# EAGLE design Shruthi-Analog-CS80-SVF-v01 (EAGLE 5.12)
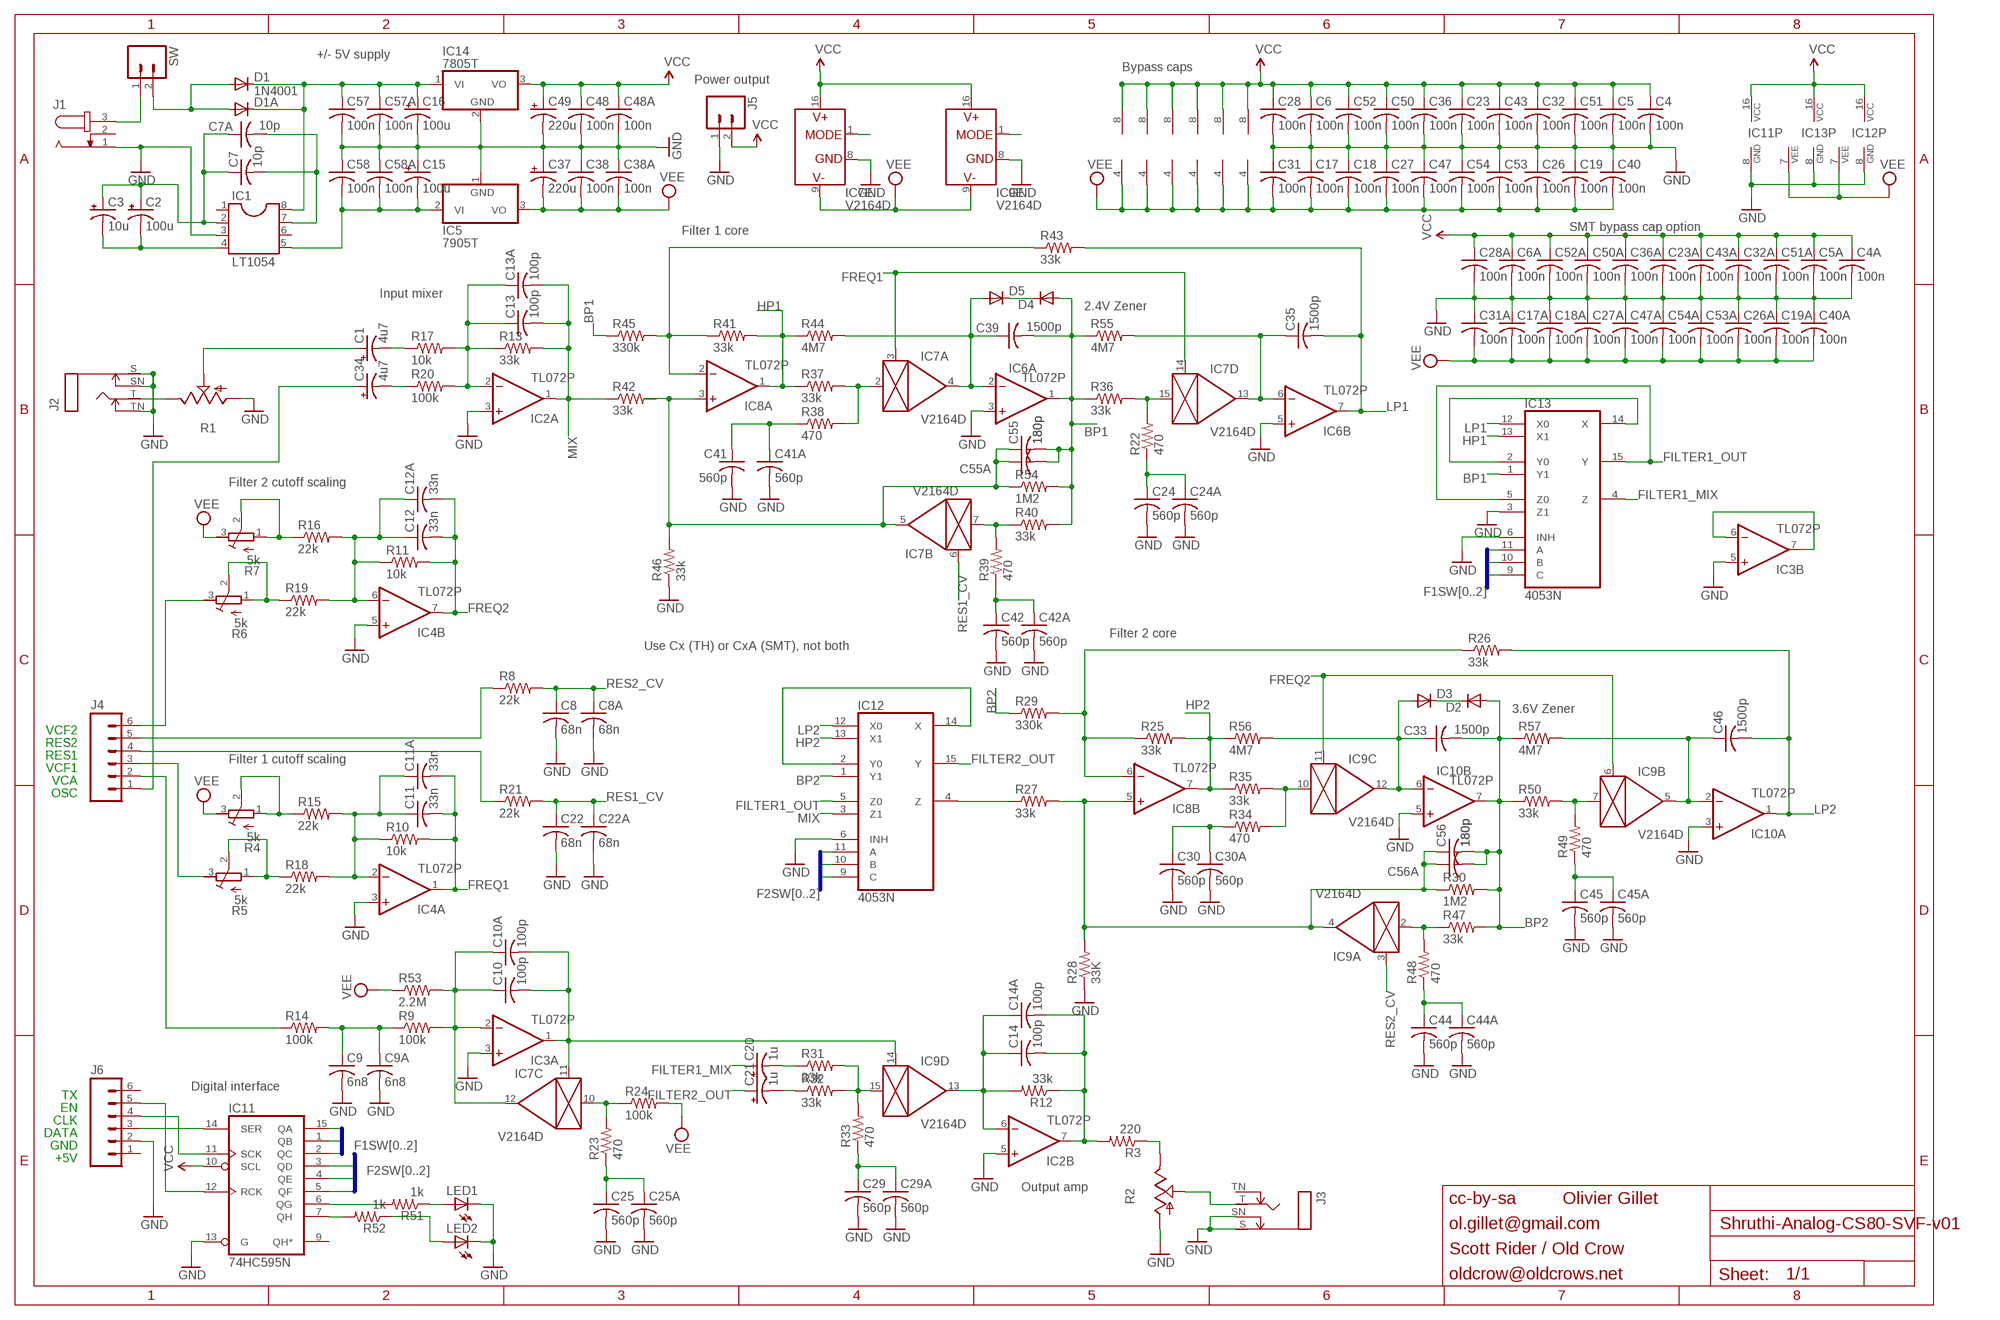
[diagram p0: schematic, sheet 1]

## Parts
C1  4u7  CPOL-USE2.5-6  [E2,5-6]
C2  100u  CPOL-USE2.5-6  [E2,5-6]
C3  10u  CPOL-USE2.5-5  [E2,5-5]
C4  100n  C-US050-025X075  [C050-025X075]
C4A  100n  C-USC0805K  [C0805K]
C5  100n  C-US050-025X075  [C050-025X075]
C5A  100n  C-USC0805K  [C0805K]
C6  100n  C-US050-025X075  [C050-025X075]
C6A  100n  C-USC0805K  [C0805K]
C7  10p  C-US050-025X075  [C050-025X075]
C7A  10p  C-USC0805K  [C0805K]
C8  68n  C-US050-025X075  [C050-025X075]
C8A  68n  C-USC0805K  [C0805K]
C9  6n8  C-US050-025X075  [C050-025X075]
C9A  6n8  C-USC0805K  [C0805K]
C10  100p  C-US050-025X075  [C050-025X075]
C10A  100p  C-USC0805K  [C0805K]
C11  33n  C-US050-025X075  [C050-025X075]
C11A  33n  C-USC0805K  [C0805K]
C12  33n  C-US050-025X075  [C050-025X075]
C12A  33n  C-USC0805K  [C0805K]
C13  100p  C-US050-025X075  [C050-025X075]
C13A  100p  C-USC0805K  [C0805K]
C14  100p  C-US050-025X075  [C050-025X075]
C14A  100p  C-USC0805K  [C0805K]
C15  100u  CPOL-USE2.5-7  [E2,5-7]
C16  100u  CPOL-USE2.5-7  [E2,5-7]
C17  100n  C-US050-025X075  [C050-025X075]
C17A  100n  C-USC0805K  [C0805K]
C18  100n  C-US050-025X075  [C050-025X075]
C18A  100n  C-USC0805K  [C0805K]
C19  100n  C-US050-025X075  [C050-025X075]
C19A  100n  C-USC0805K  [C0805K]
C20  1u  CPOL-USE2-5  [E2-5]
C21  1u  CPOL-USE2-5  [E2-5]
C22  68n  C-US050-025X075  [C050-025X075]
C22A  68n  C-USC0805K  [C0805K]
C23  100n  C-US050-025X075  [C050-025X075]
C23A  100n  C-USC0805K  [C0805K]
C24  560p  C-US050-025X075  [C050-025X075]
C24A  560p  C-USC0805K  [C0805K]
C25  560p  C-US050-025X075  [C050-025X075]
C25A  560p  C-USC0805K  [C0805K]
C26  100n  C-US050-025X075  [C050-025X075]
C26A  100n  C-USC0805K  [C0805K]
C27  100n  C-US050-025X075  [C050-025X075]
C27A  100n  C-USC0805K  [C0805K]
C28  100n  C-US050-025X075  [C050-025X075]
C28A  100n  C-USC0805K  [C0805K]
C29  560p  C-US050-025X075  [C050-025X075]
C29A  560p  C-USC0805K  [C0805K]
C30  560p  C-US050-025X075  [C050-025X075]
C30A  560p  C-USC0805K  [C0805K]
C31  100n  C-US050-025X075  [C050-025X075]
C31A  100n  C-USC0805K  [C0805K]
C32  100n  C-US050-025X075  [C050-025X075]
C32A  100n  C-USC0805K  [C0805K]
C33  1500p  C-US025-025X050  [C025-025X050]
C34  4u7  CPOL-USE2.5-6  [E2,5-6]
C35  1500p  C-US025-025X050  [C025-025X050]
C36  100n  C-US050-025X075  [C050-025X075]
C36A  100n  C-USC0805K  [C0805K]
C37  220u  CPOL-USE3.5-8  [E3,5-8]
C38  100n  C-US050-025X075  [C050-025X075]
C38A  100n  C-USC0805K  [C0805K]
C39  1500p  C-US025-025X050  [C025-025X050]
C40  100n  C-US050-025X075  [C050-025X075]
C40A  100n  C-USC0805K  [C0805K]
C41  560p  C-US050-025X075  [C050-025X075]
C41A  560p  C-USC0805K  [C0805K]
C42  560p  C-US050-025X075  [C050-025X075]
C42A  560p  C-USC0805K  [C0805K]
C43  100n  C-US050-025X075  [C050-025X075]
C43A  100n  C-USC0805K  [C0805K]
C44  560p  C-US050-025X075  [C050-025X075]
C44A  560p  C-USC0805K  [C0805K]
C45  560p  C-US050-025X075  [C050-025X075]
C45A  560p  C-USC0805K  [C0805K]
C46  1500p  C-US025-025X050  [C025-025X050]
C47  100n  C-US050-025X075  [C050-025X075]
C47A  100n  C-USC0805K  [C0805K]
C48  100n  C-US050-025X075  [C050-025X075]
C48A  100n  C-USC0805K  [C0805K]
C49  220u  CPOL-USE3.5-8  [E3,5-8]
C50  100n  C-US050-025X075  [C050-025X075]
C50A  100n  C-USC0805K  [C0805K]
C51  100n  C-US050-025X075  [C050-025X075]
C51A  100n  C-USC0805K  [C0805K]
C52  100n  C-US050-025X075  [C050-025X075]
C52A  100n  C-USC0805K  [C0805K]
C53  100n  C-US025-025X050  [C025-025X050]
C53A  100n  C-USC0805K  [C0805K]
C54  100n  C-US050-025X075  [C050-025X075]
C54A  100n  C-USC0805K  [C0805K]
C55  180p  C-US050-025X075  [C050-025X075]
C55A  180p  C-USC0805K  [C0805K]
C56  180p  C-US050-025X075  [C050-025X075]
C56A  180p  C-USC0805K  [C0805K]
C57  100n  C-US050-025X075  [C050-025X075]
C57A  100n  C-USC0805K  [C0805K]
C58  100n  C-US050-025X075  [C050-025X075]
C58A  100n  C-USC0805K  [C0805K]
D1  1N4001  1N4004  [DO41-10]
D1A  DIODE-SMB  [SMB]
D2  DIODE-D-5  [D-5]
D3  DIODE-D-5  [D-5]
D4  DIODE-D-5  [D-5]
D5  DIODE-D-5  [D-5]
IC1  LT1054  DIL8  [DIL08]
IC2  TL072P  [DIL08]
IC3  TL072P  [DIL08]
IC4  TL072P  [DIL08]
IC5  7905T  [TO220H]
IC6  TL072P  [DIL08]
IC7  V2164D  SSM2164P  [DIL16]
IC8  TL072P  [DIL08]
IC9  V2164D  SSM2164P  [DIL16]
IC10  TL072P  [DIL08]
IC11  74HC595N  [DIL16]
IC12  4053N  [DIL16]
IC13  4053N  [DIL16]
IC14  7805T  [TO220H]
J1  JACK-PLUG2  [SPC4078_BIG_HOLES]
J2  MONOSWS  [NMJ4HC-S]
J3  MONOSWS  [NMJ4HC-S]
J4  M06SIP  [1X06]
J5  M02PTH  [1X02]
J6  M06SIP  [1X06]
LED1  LEDCHIP-LED0603  [CHIP-LED0603]
LED2  LEDCHIP-LED0603  [CHIP-LED0603]
R1  POT_USCABLED  [CABLE_POT_6MM]
R2  POT_USCABLED  [CABLE_POT_6MM]
R3  220  R-US_0204/7  [0204/7]
R4  5k  R-TRIMM3296X  [RTRIM3296X]
R5  5k  R-TRIMM3296X  [RTRIM3296X]
R6  5k  R-TRIMM3296X  [RTRIM3296X]
R7  5k  R-TRIMM3296X  [RTRIM3296X]
R8  22k  R-US_0204/7  [0204/7]
R9  100k  R-US_0204/7  [0204/7]
R10  10k  R-US_0204/7  [0204/7]
R11  10k  R-US_0204/7  [0204/7]
R12  33k  R-US_0204/7  [0204/7]
R13  33k  R-US_0204/7  [0204/7]
R14  100k  R-US_0204/7  [0204/7]
R15  22k  R-US_0204/7  [0204/7]
R16  22k  R-US_0204/7  [0204/7]
R17  10k  R-US_0204/7  [0204/7]
R18  22k  R-US_0204/7  [0204/7]
R19  22k  R-US_0204/7  [0204/7]
R20  100k  R-US_0204/7  [0204/7]
R21  22k  R-US_0204/7  [0204/7]
R22  470  R-US_0204/7  [0204/7]
R23  470  R-US_0204/7  [0204/7]
R24  100k  R-US_0204/7  [0204/7]
R25  33k  R-US_0204/7  [0204/7]
R26  33k  R-US_0204/7  [0204/7]
R27  33k  R-US_0204/7  [0204/7]
R28  33K  R-US_0204/7  [0204/7]
R29  330k  R-US_0204/7  [0204/7]
R30  1M2  R-US_0204/7  [0204/7]
R31  33k  R-US_0204/7  [0204/7]
R32  33k  R-US_0204/7  [0204/7]
R33  470  R-US_0204/7  [0204/7]
R34  470  R-US_0204/7  [0204/7]
R35  33k  R-US_0204/7  [0204/7]
R36  33k  R-US_0204/7  [0204/7]
R37  33k  R-US_0204/7  [0204/7]
R38  470  R-US_0204/7  [0204/7]
R39  470  R-US_0204/7  [0204/7]
R40  33k  R-US_0204/7  [0204/7]
R41  33k  R-US_0204/7  [0204/7]
R42  33k  R-US_0204/7  [0204/7]
R43  33k  R-US_0204/7  [0204/7]
R44  4M7  R-US_0204/7  [0204/7]
R45  330k  R-US_0204/7  [0204/7]
R46  33k  R-US_0204/7  [0204/7]
R47  33k  R-US_0204/7  [0204/7]
R48  470  R-US_0204/7  [0204/7]
R49  470  R-US_0204/7  [0204/7]
R50  33k  R-US_0204/7  [0204/7]
R51  1k  R-US_0204/7  [0204/7]
R52  1k  R-US_0204/7  [0204/7]
R53  2.2M  R-US_0204/2V  [0204V]
R54  1M2  R-US_0204/7  [0204/7]
R55  4M7  R-US_0204/7  [0204/7]
R56  4M7  R-US_0204/7  [0204/7]
R57  4M7  R-US_0204/7  [0204/7]
SW  M02PTH  [1X02]

## Nets
BP1: C39.2 C55.2 C55A.2 D4.A IC6.1(A:OUT) IC13.1(Y1) R36.1 R40.2 R45.1 R54.2 R55.1
BP2: C33.2 C56.2 C56A.2 D2.A IC10.7(B:OUT) IC12.1(Y1) R29.1 R30.2 R47.2 R50.1 R57.1
F1SW0: IC11.15(QA) IC13.9(C)
F1SW1: IC11.1(QB) IC13.10(B)
F1SW2: IC11.2(QC) IC13.11(A)
F2SW0: IC11.3(QD) IC12.9(C)
F2SW1: IC11.4(QE) IC12.10(B)
F2SW2: IC11.5(QF) IC12.11(A)
FILTER1_MIX: C20.+ IC13.4(Z)
FILTER1_OUT: IC12.5(Z0) IC13.5(Z0) IC13.15(Y)
FILTER2_OUT: C21.+ IC12.15(Y)
FREQ1: C11.2 C11A.2 IC4.1(A:OUT) IC7.3(A:CTRL) IC7.14(D:CTRL) R10.2
FREQ2: C12.2 C12A.2 IC4.7(B:OUT) IC9.6(B:CTRL) IC9.11(C:CTRL) R11.2
GND: C4.2 C4A.2 C5.2 C5A.2 C6.2 C6A.2 C8.2 C8A.2 C9.2 C9A.2 C15.+ C16.- C17.1 C17A.1 C18.1 C18A.1 C19.1 C19A.1 C22.2 C22A.2 C23.2 C23A.2 C24.2 C24A.2 C25.2 C25A.2 C26.1 C26A.1 C27.1 C27A.1 C28.2 C28A.2 C29.2 C29A.2 C30.2 C30A.2 C31.1 C31A.1 C32.2 C32A.2 C36.2 C36A.2 C37.+ C38.1 C38A.1 C40.1 C40A.1 C41.2 C41A.2 C42.2 C42A.2 C43.2 C43A.2 C44.2 C44A.2 C45.2 C45A.2 C47.1 C47A.1 C48.2 C48A.2 C49.- C50.2 C50A.2 C51.2 C51A.2 C52.2 C52A.2 C53.1 C53A.1 C54.1 C54A.1 C57.2 C57A.2 C58.1 C58A.1 IC1.3 IC2.3(A:+IN) IC2.5(B:+IN) IC3.3(A:+IN) IC3.5(B:+IN) IC4.3(A:+IN) IC4.5(B:+IN) IC5.1(GND) IC6.3(A:+IN) IC6.5(B:+IN) IC7.8(E:GND) IC9.8(E:GND) IC10.3(A:+IN) IC10.5(B:+IN) IC11.8(GND) IC11.13(G) IC12.6(INH) IC12.8(GND) IC13.3(Z1) IC13.6(INH) IC13.8(GND) IC14.2(GND) J1.1 J2.S J2.SN J2.TN J3.S J3.SN J5.1 J6.2 LED1.C LED2.C R1.A R2.A R28.1 R46.1
HP1: IC8.1(A:OUT) IC13.13(X1) R37.1 R41.2 R44.1
HP2: IC8.7(B:OUT) IC12.13(X1) R25.2 R35.1 R56.1
LP1: C35.2 IC6.7(B:OUT) IC13.12(X0) R43.2
LP2: C46.2 IC10.1(A:OUT) IC12.12(X0) R26.2
MIX: C13.2 C13A.2 IC2.1(A:OUT) IC12.3(Z1) R13.2 R42.1
N$1: C2.+ C3.+ C7.1 C7A.1 IC1.2
N$2: C12.1 C12A.1 IC4.6(B:-IN) R11.1 R16.2 R19.2
N$3: J1.3 SW.1
N$4: C16.+ C57.1 C57A.1 D1.C D1A.C IC1.8 IC14.1(VI)
N$5: C2.- C3.- IC1.4
N$6: C13.1 C13A.1 IC2.2(A:-IN) R13.1 R17.2 R20.2
N$7: R6.1(E) R6.2(S) R19.1
N$8: J4.6 R6.3(A)
N$9: R7.1(E) R7.2(S) R16.1
N$10: IC7.10(C:IN) R23.2 R24.1
N$11: C10.1 C10A.1 IC3.2(A:-IN) IC7.12(C:OUT) R9.2 R53.2
N$12: IC8.2(A:-IN) R41.1 R43.1 R45.2
N$13: IC11.12(RCK) J6.5
N$14: IC11.14(SER) J6.3
N$15: IC11.6(QG) R51.2
N$16: IC11.11(SCK) J6.4
N$17: C24.1 C24A.1 R22.1
N$18: IC8.6(B:-IN) R25.1 R26.1 R29.2
N$19: C39.1 D5.A IC6.2(A:-IN) IC7.4(A:OUT) R44.2
N$20: C33.1 D3.A IC9.12(C:OUT) IC10.6(B:-IN) R56.2
N$21: IC7.7(B:IN) R39.2 R40.1
N$22: C9.1 C9A.1 R9.1 R14.2
N$23: C56.1 C56A.1 IC8.5(B:+IN) IC9.4(A:OUT) R27.2 R28.2 R30.1
N$24: IC9.2(A:IN) R47.1 R48.2
N$25: R2.E R3.1
N$26: IC7.15(D:IN) R22.2 R36.2
N$27: C42.1 C42A.1 R39.1
N$28: C35.1 IC6.6(B:-IN) IC7.13(D:OUT) R55.2
N$29: IC7.2(A:IN) R37.2 R38.2
N$30: C41.1 C41A.1 R38.1
N$31: C55.1 C55A.1 IC7.5(B:OUT) IC8.3(A:+IN) R42.2 R46.2 R54.1
N$32: LED1.A R51.1
N$33: D2.C D3.C
N$34: IC9.7(B:IN) R49.2 R50.2
N$35: C34.+ J4.1
N$36: C7.2 C7A.2 IC1.7
N$38: J2.T R1.E
N$39: C34.- R20.1
N$40: C11.1 C11A.1 IC4.2(A:-IN) R10.1 R15.2 R18.2
N$41: R5.1(E) R5.2(S) R18.1
N$42: J4.3 R5.3(A)
N$43: R4.1(E) R4.2(S) R15.1
N$44: C46.1 IC9.5(B:OUT) IC10.2(A:-IN) R57.2
N$45: J4.2 R14.1
N$46: C45.1 C45A.1 R49.1
N$47: J3.T R2.S
N$49: C44.1 C44A.1 R48.1
N$50: IC9.10(C:IN) R34.2 R35.2
N$51: C30.1 C30A.1 R34.1
N$52: LED2.A R52.1
N$53: IC11.7(QH) R52.2
N$55: D4.C D5.C
N$56: C10.2 C10A.2 IC3.1(A:OUT) IC7.11(C:CTRL) IC9.14(D:CTRL)
N$57: C20.- R31.1
N$58: C15.- C58.2 C58A.2 IC1.5 IC5.2(VI)
N$59: D1.A D1A.A SW.2
N$60: C21.- R32.1
N$61: IC3.6(B:-IN) IC3.7(B:OUT)
N$62: IC13.2(Y0) IC13.14(X)
N$63: C14.2 C14A.2 IC2.7(B:OUT) R3.2 R12.1
N$64: C25.1 C25A.1 R23.1
N$65: C29.1 C29A.1 R33.1
N$66: C1.+ R1.S
N$67: IC9.15(D:IN) R31.2 R32.2 R33.2
N$68: IC7.1(E:MODE)
N$69: J4.4 R21.1
N$70: C14.1 C14A.1 IC2.6(B:-IN) IC9.13(D:OUT) R12.2
N$71: IC9.1(E:MODE)
N$72: C1.- R17.1
N$73: J4.5 R8.1
N$74: IC12.2(Y0) IC12.14(X)
N$75: IC12.4(Z) R27.1
RES1_CV: C22.1 C22A.1 IC7.6(B:CTRL) R21.2
RES2_CV: C8.1 C8A.1 IC9.3(A:CTRL) R8.2
VCC: C4.1 C4A.1 C5.1 C5A.1 C6.1 C6A.1 C23.1 C23A.1 C28.1 C28A.1 C32.1 C32A.1 C36.1 C36A.1 C43.1 C43A.1 C48.1 C48A.1 C49.+ C50.1 C50A.1 C51.1 C51A.1 C52.1 C52A.1 IC2.8(P:V+) IC3.8(P:V+) IC4.8(P:V+) IC6.8(P:V+) IC7.16(E:V+) IC8.8(P:V+) IC9.16(E:V+) IC10.8(P:V+) IC11.10(SCL) IC11.16(VCC) IC12.16(VCC) IC13.16(VCC) IC14.3(VO) J5.2
VEE: C17.2 C17A.2 C18.2 C18A.2 C19.2 C19A.2 C26.2 C26A.2 C27.2 C27A.2 C31.2 C31A.2 C37.- C38.2 C38A.2 C40.2 C40A.2 C47.2 C47A.2 C53.2 C53A.2 C54.2 C54A.2 IC2.4(P:V-) IC3.4(P:V-) IC4.4(P:V-) IC5.3(VO) IC6.4(P:V-) IC7.9(E:V-) IC8.4(P:V-) IC9.9(E:V-) IC10.4(P:V-) IC12.7(VEE) IC13.7(VEE) R4.3(A) R7.3(A) R24.2 R53.1
Unconnected: IC1.1 IC1.6 IC11.9(QH*) J1.2 J3.TN J6.1 J6.6

## Buses
F1SW[0..2]
F2SW[0..2]

## Notes on the sheet
- +/- 5V supply
- Bypass caps
- Power output
- SMT bypass cap option
- Filter 1 core
- Input mixer
- 2.4V Zener
- Filter 2 cutoff scaling
- Filter 2 core
- Use Cx (TH) or CxA (SMT), not both
- 3.6V Zener
- VCF2
- RES2
- RES1
- VCF1 | Filter 1 cutoff scaling
- VCA
- OSC
- TX | Digital interface
- EN
- CLK
- DATA
- GND
- +5V
- Output amp
- cc-by-sa | Olivier Gillet
- ol.gillet@gmail.com
- Scott Rider / Old Crow
- oldcrow@oldcrows.net

## Library data of the parts
C1-C3 C15 C16 C20 C21 C34 C37 C49 = rcl:CPOL-US: POLARIZED CAPACITOR, American symbol
C4 C4A C5 C5A C6 C6A C7 C7A C8 C8A C9 C9A C10 C10A C11 C11A C12 C12A C13 C13A C14 C14A C17 C17A C18 C18A C19 C19A C22 C22A C23 C23A C24 C24A C25 C25A C26 C26A C27 C27A C28 C28A C29 C29A C30 C30A C31 C31A C32 C32A C33 C35 C36 C36A C38 C38A C39 C40 C40A C41 C41A C42 C42A C43 C43A C44 C44A C45 C45A C46 C47 C47A C48 C48A C50 C50A C51 C51A C52 C52A C53 C53A C54 C54A C55 C55A C56 C56A C57 C57A C58 C58A = rcl:C-US: CAPACITOR, American symbol
D1 = diode:1N4004: DIODE general purpose rectifier, 1 A
D1A D2-D5 = diode:DIODE-: DIODE
IC1 = ic-package:DIL8: Dual In Line / Socket
IC2-IC4 IC6 IC8 IC10 = og-linear:TL072: OP AMP
IC5 = linear:79*: Negative VOLTAGE REGULATOR
IC7 IC9 = ssm2164:SSM2164
IC11 = 74xx-eu:74*595: 8-bit SHIFT REGISTER, output latch
IC12 IC13 = 40xx:4053: Triple 2-channel ANALOG MULTIPLEXER
IC14 = linear:78*: Positive VOLTAGE REGULATOR Source: http://cache.national.com/ds/LM/LM78L05.pdf http://www.fairchildsemi.com/ds/LM/LM7805.pdf
J1 = con-jack2:JACK-PLUG: DC POWER JACK Power Jack, DC, Right Angle, Through Hole, Rated 5A at 16VDC, PC Terminals Distributor: Farnell (www.Farnell.de) Drawing: 84N1161.pdf / 84N1162.pdf Manufacturer: SPC Technology (www.spctechnology.com) Type: SPC4077 / SPC 4078
J2 J3 = gm-jacks:MONOSW
J4 J6 = SparkFun:M06: Header 6 Standard 6-pin 0.1" header. Use with straight break away headers (SKU : PRT-00116), right angle break away headers (PRT-00553), swiss pins (PRT-00743), machine pins (PRT-00117), and female headers (PRT-00115). Molex polarized connector foot print use with SKU : PRT-08094 with associated crimp pins and housings. NOTES ON THE VARIANTS LOCK and LOCK_LONGPADS... This footprint was designed to help hold the alignment of a through-hole component (i.e. 6-pin header) while soldering it into place. You may notice that each hole has been shifted either up or down by 0.005 of an inch from it's more standard position (which is a perfectly straight line). This slight alteration caused the pins (the squares in the middle) to touch the edges of the holes. Because they are alternating, it causes a "brace" to hold the component in place. 0.005 has proven to be the perfect amount of "off-center" position when using our standard breakaway headers. Although looks a little odd when you look at the bare footprint, once you have a header in there, the alteration is very hard to notice. Also, if you push a header all the way into place, it is covered up entirely on the bottom side. This idea of altering the position of holes to aid alignment will be further integrated into the Sparkfun Library for other footprints. It can help hold any component with 3 or more connection pins.
J5 SW = SparkFun:M02: Header 2 Standard 2-pin 0.1" header. Use with straight break away headers (SKU : PRT-00116), right angle break away headers (PRT-00553), swiss pins (PRT-00743), machine pins (PRT-00117), and female headers (PRT-00115). Molex polarized connector foot print use with SKU : PRT-08233 with associated crimp pins and housings.
LED1 LED2 = led:LED: LED OSRAM: - CHIPLED LG R971, LG N971, LY N971, LG Q971, LY Q971, LO R971, LY R971 LH N974, LH R974 LS Q976, LO Q976, LY Q976 LO Q996 - Hyper CHIPLED LW Q18S LB Q993, LB Q99A, LB R99A - SideLED LS A670, LO A670, LY A670, LG A670, LP A670 LB A673, LV A673, LT A673, LW A673 LH A674 LY A675 LS A676, LA A676, LO A676, LY A676, LW A676 LS A679, LY A679, LG A679 - Hyper Micro SIDELED® LS Y876, LA Y876, LO Y876, LY Y876 LT Y87S - SmartLED LW L88C, LW L88S LB L89C, LB L89S, LG L890 LS L89K, LO L89K, LY L89K LS L896, LA L896, LO L896, LY L896 - TOPLED LS T670, LO T670, LY T670, LG T670, LP T670 LSG T670, LSP T670, LSY T670, LOP T670, LYG T670 LG T671, LOG T671, LSG T671 LB T673, LV T673, LT T673, LW T673 LH T674 LS T676, LA T676, LO T676, LY T676, LB T676, LH T676, LSB T676, LW T676 LB T67C, LV T67C, LT T67C, LS T67K, LO T67K, LY T67K, LW E67C LS E67B, LA E67B, LO E67B, LY E67B, LB E67C, LV E67C, LT E67C LW T67C LS T679, LY T679, LG T679 LS T770, LO T770, LY T770, LG T770, LP T770 LB T773, LV T773, LT T773, LW T773 LH T774 LS E675, LA E675, LY E675, LS T675 LS T776, LA T776, LO T776, LY T776, LB T776 LHGB T686 LT T68C, LB T68C - Hyper Mini TOPLED® LB M676 - Mini TOPLED Santana® LG M470 LS M47K, LO M47K, LY M47K Source: http://www.osram.convergy.de LUXEON: - LUMILED® LXK2-PW12-R00, LXK2-PW12-S00, LXK2-PW14-U00, LXK2-PW14-V00 LXK2-PM12-R00, LXK2-PM12-S00, LXK2-PM14-U00 LXK2-PE12-Q00, LXK2-PE12-R00, LXK2-PE12-S00, LXK2-PE14-T00, LXK2-PE14-U00 LXK2-PB12-K00, LXK2-PB12-L00, LXK2-PB12-M00, LXK2-PB14-N00, LXK2-PB14-P00, LXK2-PB14-Q00 LXK2-PR12-L00, LXK2-PR12-M00, LXK2-PR14-Q00, LXK2-PR14-R00 LXK2-PD12-Q00, LXK2-PD12-R00, LXK2-PD12-S00 LXK2-PH12-R00, LXK2-PH12-S00 LXK2-PL12-P00, LXK2-PL12-Q00, LXK2-PL12-R00 Source: www.luxeon.com KINGBRIGHT: KA-3528ASYC Source: www.kingbright.com
R1 R2 = pot-alps:POT_US
R3 R8-R57 = rcl:R-US_: RESISTOR, American symbol
R4-R7 = rcl:R-TRIMM: Trimm resistor

## Board
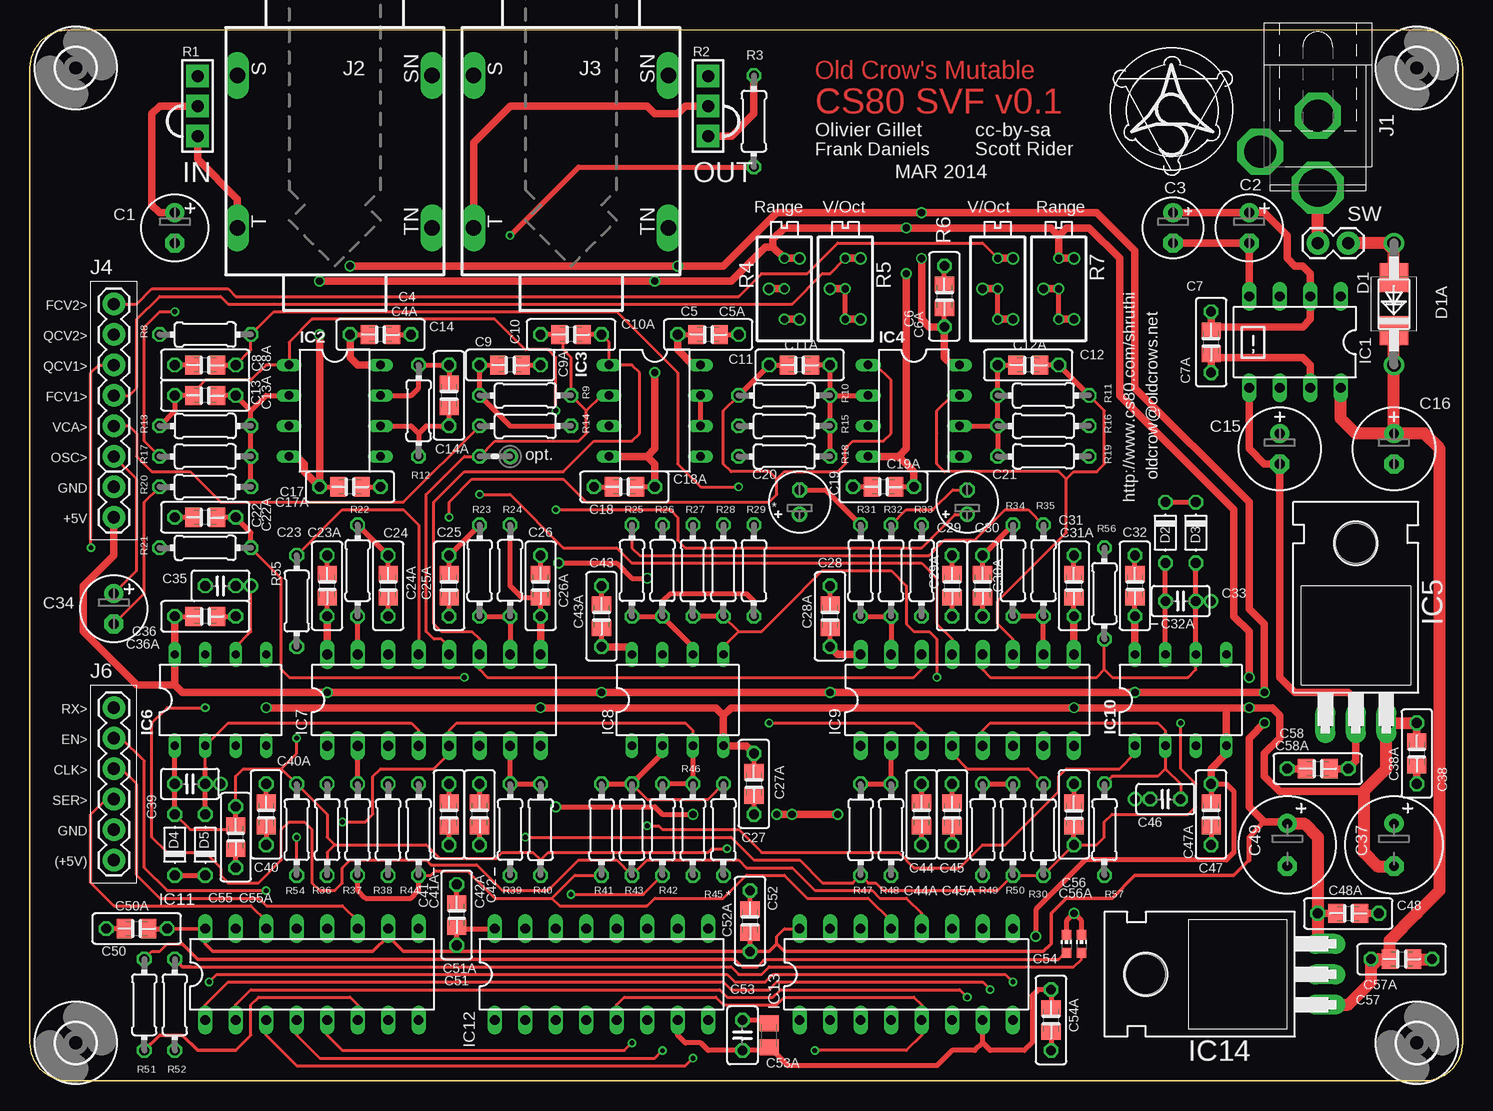
[diagram p1: board, top side]
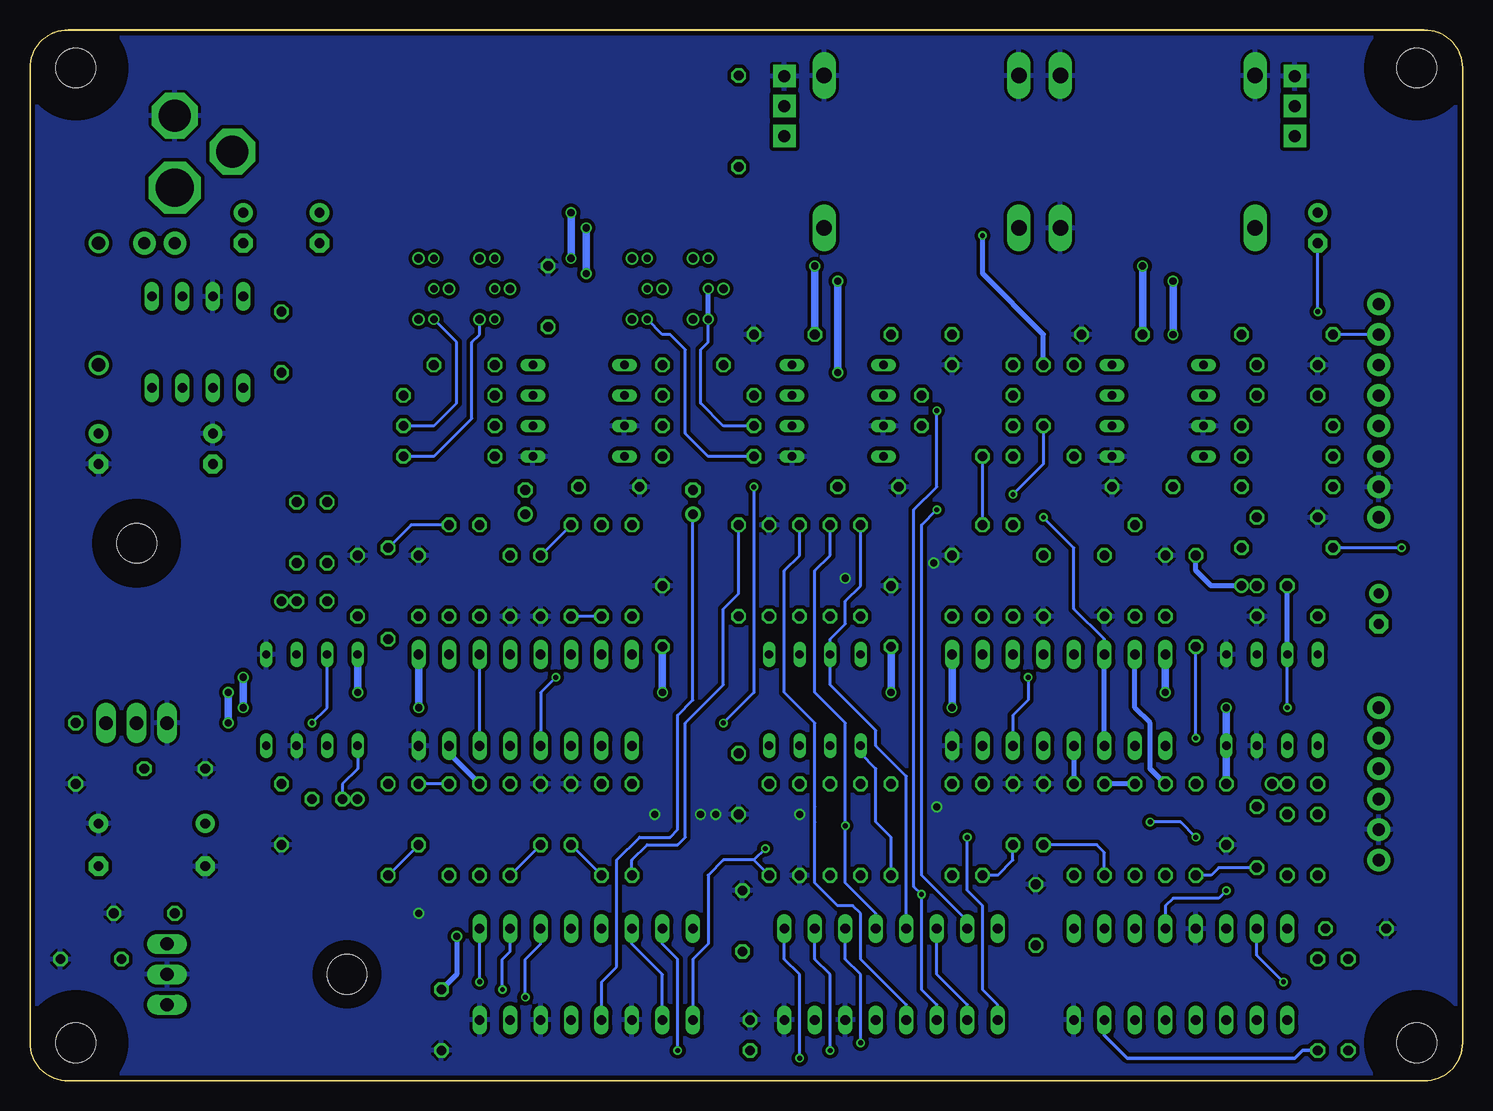
[diagram p2: board, bottom side, seen from below]

Size 119.38 x 87.62 mm. Coordinates in mm from the lower left corner, seen from the top.
Outline: 116.2,0 arc90 119.38,3.17 119.38,84.45 arc90 116.22,87.62 3.17,87.62 arc90 0,84.45 0,3.17 arc90 3.18,0 116.2,0
Copper layers (1*2*15*16): Top 0.035mm / dielectric 0.2mm / Route2 0.0175mm / dielectric 1.1mm / Route15 0.0175mm / dielectric 0.2mm / Bottom 0.035mm
Design rules "SeeedStudio_DRU_no_angle_20130527": minimum track width 6mil, minimum drill 12mil, track to track 6mil, track to pad 6mil, pad to pad 6mil, via to via 6mil, smd to smd 0mil, copper to edge 10mil, drill to drill 10mil, minimum pad ring 6mil, minimum via ring 6mil, stop-mask expansion 2mil, vias tented up to drill 25mil, thermal gap 10mil
bRestrict: area 107.3,41.7 to 113.7,48
Milling: 8 lines

### Footprints (pad centres in the part's own frame; a part is rotated, then mirrored left to right if it is on the bottom)
E2,5-6 = drill 0.813 pad 1.6 round: + -1.27,0 | drill 0.813 pad 1.6 octagon: - 1.27,0
E2,5-5 = drill 0.813 pad 1.6 round: + -1.27,0 | drill 0.813 pad 1.6 octagon: - 1.27,0
C050-025X075 = drill 0.813 octagon: 1 -2.54,0; 2 2.54,0
C0805K = smd 1.3 x 1.6: 1 -1,0; 2 1,0
E2,5-7 = drill 0.813 pad 1.6 round: + -1.27,0 | drill 0.813 pad 1.6 octagon: - 1.27,0
E2-5 = drill 0.813 pad 1.27 round: + -1.016,0 | drill 0.813 pad 1.27 octagon: - 1.016,0
C025-025X050 = drill 0.813 octagon: 1 -1.27,0; 2 1.27,0
E3,5-8 = drill 0.813 pad 1.6 round: + -1.778,0 | drill 0.813 pad 1.6 octagon: - 1.778,0
DO41-10 = drill 1.118 round: A 5.08,0; C -5.08,0
SMB = smd 2.4 x 2.4: A 2.2,0; C -2.2,0
D-5 = drill 0.813 octagon: A 2.54,0; C -2.54,0
DIL08 = drill 0.813 long: 1 -3.81,-3.81; 2 -1.27,-3.81; 3 1.27,-3.81; 4 3.81,-3.81; 5 3.81,3.81; 6 1.27,3.81; 7 -1.27,3.81; 8 -3.81,3.81
DIL08' = drill 0.7 long: 1 -3.81,-3.81; 2 -1.27,-3.81; 3 1.27,-3.81; 4 3.81,-3.81; 5 3.81,3.81; 6 1.27,3.81; 7 -1.27,3.81; 8 -3.81,3.81
TO220H = drill 1.118 long: 1 -2.54,-10.16; 2 0,-10.16; 3 2.54,-10.16 | hole 3.302: 0,4.826
DIL16 = drill 0.813 long: 1 -8.89,-3.81; 2 -6.35,-3.81; 3 -3.81,-3.81; 4 -1.27,-3.81; 5 1.27,-3.81; 6 3.81,-3.81; 7 6.35,-3.81; 8 8.89,-3.81; 9 8.89,3.81; 10 6.35,3.81; 11 3.81,3.81; 12 1.27,3.81; 13 -1.27,3.81; 14 -3.81,3.81; 15 -6.35,3.81; 16 -8.89,3.81
SPC4078_BIG_HOLES = drill 2.667 pad 3.81 octagon: 1 -0.46,0; 2 2.54,-4.8 | drill 3.175 pad 4.318 octagon: 3 5.54,0
NMJ4HC-S = drill 1.3 long: S 5.08,8.115; SN 5.08,-8.115; T -7.62,8.115; TN -7.62,-8.115
1X06 = drill 1.016 pad 1.88 round: 1 0,0; 2 2.54,0; 3 5.08,0; 4 7.62,0; 5 10.16,0; 6 12.7,0
1X02 = drill 1.016 pad 1.88 round: 1 0,0; 2 2.54,0
CHIP-LED0603 = smd 0.8 x 0.8: A 0,-0.75; C 0,0.75
CABLE_POT_6MM = drill 1 pad 1.88 square: A -2.5,0; E 2.5,0; S 0,0
0204/7 = drill 0.813 octagon: 1 -3.81,0; 2 3.81,0
RTRIM3296X = drill 0.61 round: 1 0,-2.54; 2 0,0; 3 0,2.54
0204V = drill 0.813 octagon: 1 -1.27,0; 2 1.27,0
3,3 = hole 3.3: 0,0

### Placement (x,y rotation side)
C1  12.07,71.12 270 top
C2  101.6,71.12 270 top
C3  95.25,71.12 270 top
C4  29.21,62.23 0 top
C4A  29.21,62.23 0 top
C5  56.52,62.23 0 top
C5A  56.52,62.23 0 top
C6  76.2,65.41 90 top
C6A  76.2,65.41 90 top
C7  98.42,61.59 270 top
C7A  98.42,61.59 270 top
C8  14.61,59.69 180 top
C8A  14.61,59.69 180 top
C9  40.01,59.69 0 top
C9A  40.01,59.69 0 top
C10  45.09,62.23 0 top
C10A  45.09,62.23 0 top
C11  64.14,59.69 180 top
C11A  64.14,59.69 180 top
C12  83.19,59.69 0 top
C12A  83.19,59.69 0 top
C13  14.61,57.15 180 top
C13A  14.61,57.15 180 top
C14  34.93,57.15 90 top
C14A  34.93,57.15 90 top
C15  104.14,52.71 270 top
C16  113.67,52.71 270 top
C17  26.67,49.53 180 top
C17A  26.67,49.53 180 top
C18  49.53,49.53 0 top
C18A  49.53,49.53 0 top
C19  71.12,49.53 0 top
C19A  71.12,49.53 0 top
C20  64.14,48.26 90 top
C21  78.11,48.26 90 top
C22  14.61,46.99 180 top
C22A  14.61,46.99 180 top
C23  24.77,41.28 90 top
C23A  24.77,41.28 90 top
C24  29.84,41.28 270 top
C24A  29.84,41.28 270 top
C25  34.93,41.28 270 top
C25A  34.93,41.28 270 top
C26  42.55,41.28 270 top
C26A  42.55,41.28 270 top
C27  60.33,24.76 90 top
C27A  60.33,24.76 90 top
C28  66.67,38.73 90 top
C28A  66.67,38.73 90 top
C29  76.83,41.28 270 top
C29A  76.83,41.28 270 top
C30  79.38,41.28 270 top
C30A  79.38,41.28 270 top
C31  87,41.28 270 top
C31A  87,41.28 270 top
C32  92.08,41.28 90 top
C32A  92.08,41.28 90 top
C33  95.89,40.01 180 top
C34  6.99,39.37 270 top
C35  15.88,41.28 180 top
C36  14.61,38.73 0 top
C36A  14.61,38.73 0 top
C37  113.67,19.68 270 top
C38  115.57,27.3 90 top
C38A  115.57,27.3 90 top
C39  13.34,24.76 180 top
C40  19.68,22.22 90 top
C40A  19.68,22.22 90 top
C41  34.93,22.22 90 top
C41A  34.93,22.22 90 top
C42  37.47,22.22 90 top
C42A  37.47,22.22 90 top
C43  47.62,38.73 90 top
C43A  47.62,38.73 90 top
C44  74.3,22.22 90 top
C44A  74.3,22.22 90 top
C45  76.83,22.22 90 top
C45A  76.83,22.22 90 top
C46  94.61,23.49 180 top
C47  98.42,22.22 90 top
C47A  98.42,22.22 90 top
C48  109.86,13.97 0 top
C48A  109.86,13.97 0 top
C49  104.78,19.68 270 top
C50  8.89,12.7 180 top
C50A  8.89,12.7 180 top
C51  35.56,13.84 90 top
C51A  35.56,13.84 90 top
C52  60.01,13.34 90 top
C52A  60.01,13.34 90 top
C53  59.37,3.81 270 top
C53A  61.59,3.81 270 top
C54  85.09,5.08 90 top
C54A  85.09,5.08 90 top
C55  17.14,20.32 90 top
C55A  17.14,20.32 90 top
C56  87,22.22 270 top
C56A  87,22.22 270 top
C57  114.3,10.16 0 top
C57A  114.3,10.16 0 top
C58  107.31,26.04 0 top
C58A  107.31,26.04 0 top
D1  113.67,64.77 90 top
D1A  113.67,64.77 90 top
D2  94.61,45.72 270 top
D3  97.16,45.72 270 top
D4  12.07,19.68 90 top
D5  14.61,19.68 90 top
IC1  105.41,61.59 180 top
IC2  TL072P  [DIL08']  25.4,55.88 270 top
IC3  TL072P  [DIL08']  52.07,55.88 270 top
IC4  TL072P  [DIL08']  73.66,55.88 270 top
IC5  110.49,40.01 0 top
IC6  TL072P  [DIL08']  15.88,31.75 0 top
IC7  33.66,31.75 0 top
IC8  TL072P  [DIL08']  53.98,31.75 0 top
IC9  78.11,31.75 0 top
IC10  TL072P  [DIL08']  95.89,31.75 0 top
IC11  23.5,8.89 0 top
IC12  47.62,8.89 0 top
IC13  73.03,8.89 0 top
IC14  97.79,8.89 90 top
J1  107.31,80.01 270 top
J2  25.4,78.74 90 top
J3  45.09,78.74 90 top
J4  6.99,52.07 90 top
J5  6.99,49.53 270 top
J6  6.99,18.41 90 top
LED1  86.36,11.43 0 top
LED2  87.63,11.43 0 top
R1  13.97,81.28 270 top
R2  56.52,81.28 270 top
R3  60.33,80.01 270 top
R4  62.87,66.04 0 top
R5  67.95,66.04 0 top
R6  80.64,66.04 0 top
R7  85.72,66.04 0 top
R8  14.61,62.23 0 top
R9  41.27,57.15 0 top
R10  62.87,57.15 180 top
R11  84.45,57.15 0 top
R12  32.38,55.88 270 top
R13  14.61,54.61 180 top
R14  41.27,54.61 0 top
R15  62.87,54.61 0 top
R16  84.45,54.61 180 top
R17  14.61,52.07 0 top
R18  62.87,52.07 0 top
R19  84.45,52.07 180 top
R20  14.61,49.53 0 top
R21  14.61,44.45 0 top
R22  27.3,42.55 270 top
R23  37.47,42.55 270 top
R24  40.01,42.55 90 top
R25  50.16,42.55 90 top
R26  52.7,42.55 90 top
R27  55.24,42.55 270 top
R28  57.78,42.55 270 top
R29  60.33,42.55 270 top
R30  84.45,20.95 270 top
R31  69.22,42.55 270 top
R32  71.75,42.55 270 top
R33  74.3,42.55 270 top
R34  81.92,42.55 270 top
R35  84.45,42.55 270 top
R36  24.77,20.95 90 top
R37  27.3,20.95 90 top
R38  29.84,20.95 90 top
R39  40.01,20.95 90 top
R40  42.55,20.95 270 top
R41  47.62,20.95 270 top
R42  52.7,20.95 90 top
R43  50.16,20.95 270 top
R44  32.38,20.95 90 top
R45  57.78,20.95 90 top
R46  55.24,20.95 90 top
R47  69.22,20.95 270 top
R48  71.75,20.95 90 top
R49  79.38,20.95 90 top
R50  81.92,20.95 90 top
R51  9.53,6.35 270 top
R52  12.07,6.35 270 top
R53  38.73,52.07 180 top
R54  22.23,20.95 90 top
R55  22.23,40.01 90 top
R56  89.53,40.64 270 top
R57  89.53,20.95 90 top
SW  107.31,69.85 0 top
U$1  [3,3]  3.81,84.45 0 top
U$2  [3,3]  115.57,84.45 0 top
U$3  [3,3]  3.81,3.17 0 top
U$4  [3,3]  115.57,3.17 0 top

### Tracks (layer width: path | path; a pad name or v marks a point on that pad's centre or on a via)
BP1  (via drill 0.41)
  Top 0.254: 42.55,18.41 43.18,19.05 56.52,19.05 56.83,19.37 v58.1,19.37 | 42.55,18.41 41.91,19.05 39.37,19.05 38.86,18.54 34.16,18.54 33.02,19.68 25.4,19.68 | 42.55,18.41 R40.2 | D4.A 13.34,20.95 15.24,20.95 16.78,20.95 C55A.2 | R36.1 24.77,19.05 25.4,19.68 | 25.4,19.68 24.77,20.32 24.77,22.22 R54.2 20.96,26.04 | 20.96,26.04 17.78,26.04 17.14,25.4 C55.2 | v22.23,28.57 22.23,27.3 20.96,26.04
  Top 0.406: IC6.1 C39.2 D4.A | C55A.2 C55.2
  Bottom 0.254: IC13.1 64.14,10.16 62.87,11.43 62.87,17.14 61.59,18.41 59.05,18.41 | 59.05,18.41 R45.1 | v22.23,28.57 R55.1 | v58.1,19.37 59.05,18.41
BP2  (via drill 0.41)
  Top 0.254: v41.27,20.32 58.42,20.32 60.33,18.41 64.14,18.41 66.04,16.51 68.58,16.51 R47.2 69.85,16.51 70.48,16.51 71.12,15.88 80.64,15.88 R50.1 R30.2 C56.2 88.9,19.68 89.53,20.32 89.53,21.59 90.17,22.22 96.52,22.22 97.16,22.86 97.16,24.76 95.89,26.04 v95.89,29.84
  Top 0.406: IC10.7 C33.2 D2.A | C56.2 C56A.2
  Bottom 0.254: IC12.1 38.73,6.35 40.01,7.62 40.01,14.61 41.27,15.88 v41.27,20.32 | R29.1 60.33,40.64 61.59,39.37 61.59,33.02 64.77,29.84 64.77,20.32 65.41,19.68 67.95,19.68 69.22,18.41 R47.2 | v95.89,29.84 94.61,31.11 IC10.7 | C56.2 R57.1
F1SW0  (via drill 0.41)
  Top 0.254: v14.92,8.26 15.56,8.89 58.1,8.89 58.74,8.26 61.28,8.26 61.91,8.89 80.64,8.89 81.28,8.89 v81.92,8.26
  Bottom 0.254: v81.92,8.26 IC13.9 | IC11.15 17.14,10.48 v14.92,8.26
F1SW1  (via drill 0.41)
  Top 0.254: IC11.1 14.61,6.35 16.51,8.26 57.78,8.26 58.42,7.62 61.59,7.62 62.23,8.26 79.38,8.26 v80.01,7.62
  Bottom 0.254: IC13.10 79.38,10.79 80.01,10.16 v80.01,7.62
F1SW2  (via drill 0.41)
  Top 0.254: IC11.2 17.14,6.35 18.41,7.62 57.47,7.62 58.1,6.98 61.91,6.98 62.55,7.62 77.47,7.62 v78.11,6.98
  Bottom 0.254: v78.11,6.98 78.11,10.16 76.83,11.43 IC13.11
F2SW0  (via drill 0.41)
  Top 0.254: IC11.3 19.68,3.81 22.23,1.27 54.61,1.27 v55.24,1.91
  Bottom 0.254: v55.24,1.91 55.24,8.89 56.52,10.16 IC12.9
F2SW1  (via drill 0.41)
  Top 0.254: IC11.4 22.23,3.81 24.13,1.91 52.07,1.91 v52.7,2.54
  Bottom 0.254: v52.7,2.54 52.7,8.89 53.98,10.16 IC12.10
F2SW2  (via drill 0.41)
  Top 0.254: IC11.5 24.77,3.81 26.04,2.54 49.53,2.54 v50.16,3.17
  Bottom 0.254: v50.16,3.17 50.16,8.89 51.44,10.16 IC12.11
FILTER1_MIX
  Bottom 0.254: IC13.4 71.75,8.26 70.48,9.53 70.48,18.41 68.58,20.32 66.04,20.32 65.41,20.95 65.41,30.48 64.14,31.75 C20.+
FILTER1_OUT  (via drill 0.41)
  Top 0.254: v65.41,2.54 73.03,2.54 74.3,3.81 IC13.5 74.3,6.35 73.66,6.98 62.87,6.98 62.23,6.35 57.78,6.35 57.15,6.98 49.53,6.98 48.89,6.35 IC12.5
  Bottom 0.254: IC13.15 66.67,11.43 65.41,10.16 v65.41,2.54
FILTER2_OUT  (via drill 0.41)
  Top 0.254: v43.81,47.62 53.34,47.62 53.98,46.99 53.98,45.09 54.61,44.45 74.3,44.45 77.09,47.24 C21.+
  Bottom 0.254: IC12.15 41.27,13.34 45.09,17.14 45.09,46.36 v43.81,47.62
FREQ1  (via drill 0.41)
  Top 0.254: v34.93,46.99 34.93,48.26 36.83,50.16 44.45,50.16 46.35,48.26 61.59,48.26 62.23,48.9 62.23,50.16 | IC4.1 70.48,59.69 71.75,58.42 71.75,53.98 71.12,53.34 68.58,53.34 67.95,52.71 67.95,51.44 67.31,50.8 62.87,50.8 62.23,50.16 | R10.2 57.78,55.88 57.78,51.44 58.42,50.8 61.59,50.8 62.23,50.16
  Top 0.406: R10.2 C11.2 C11A.2
  Bottom 0.254: IC7.14 29.84,36.83 32.38,39.37 32.38,44.45 v34.93,46.99
  Bottom 0.406: IC7.3 IC7.14
FREQ2
  Top 0.254: R11.2 89.53,55.88 89.53,51.44 88.9,50.8 87,50.8 86.36,50.16 | IC9.11 81.92,36.83 80.64,38.1 80.64,40.01 86.36,45.72 86.36,50.16 | IC4.7 76.83,57.15 75.56,55.88 75.56,53.98 75.56,51.44 76.2,50.8 85.72,50.8 86.36,50.16
  Top 0.406: R11.2 C12.2 C12A.2
  Bottom 0.254: IC9.6 IC9.11
GND  (via drill 0.6)
  Top 0.406: v43.81,22.86 52.07,22.86 52.7,22.22 v55.24,22.22 | v44.07,43.18 48.89,43.18 50.16,41.91 v51.44,41.91 | LED1.C 86.36,13.34 v87,13.97 87.63,13.34 LED2.C | C28A.2 C28.2 | C31A.1 C31.1 | C6A.2 C6.2 | C17A.1 C17.1 | C52A.2 C52.2 | C18.1 C18A.1 | C50A.2 C50.2 | C36A.2 C36.2 | C47A.1 C47.1 | C23A.2 C23.2 | C24.2 C24A.2 | C41A.2 C41.2 | C42A.2 C42.2 | C51A.2 C51.2 | C19A.1 C19.1 | C43A.2 C43.2 | C32A.2 C32.2 | C27A.1 C27.1 | C5A.2 C5.2 | C53A.1 61.23,4.81 60.96,5.08 C53.1 | C54A.1 C54.1 | C4A.2 C4.2 | C26A.1 C26.1 | C40A.1 C40.1 | C25.2 C25A.2 | C29.2 C29A.2 | C44A.2 C44.2 | C45A.2 C45.2 | C30.2 C30A.2 | C8A.2 C8.2 | C22A.2 C22.2 | C9A.2 C9.2
  Top 0.61: v62.23,22.22 v63.5,22.22 v67.31,22.22 | C38A.1 C38.1 | C48A.2 C48.2 | C58.1 C58A.1
  Top 1.016: C57A.2 C57.2
  pour Bottom (isolate 0.305): 0.64,87 0.64,0.64 118.75,0.64 118.75,87
HP1
  Top 0.254: IC13.13 71.75,13.34 69.85,15.24 64.77,15.24 62.87,17.14 59.69,17.14 57.78,15.24 52.07,15.24 51.44,14.61 44.13,14.61 43.5,15.24 | R41.2 45.4,17.14 43.5,15.24 | 43.5,15.24 38.73,15.24 36.45,17.53 33.78,17.53 33.4,17.14 R44.1
  Top 0.406: R37.1 27.3,15.88 27.94,15.24 31.75,15.24 32.38,15.88 R44.1
  Bottom 0.254: R41.2 47.62,20.32 48.89,21.59 48.89,26.04 50.16,27.3 IC8.1
HP2
  Top 0.254: R35.1 83.19,47.62 81.28,47.62 78.74,45.09 76.2,45.09 74.93,43.82 50.8,43.82 50.16,44.45 R25.2
  Bottom 0.254: R25.2 50.16,45.72 50.16,41.28 51.44,40.01 51.44,38.1 52.7,36.83 IC8.7 52.7,33.02 48.89,29.21 48.89,27.94 46.35,25.4 IC12.13 | R35.1 87.63,46.36 R56.1
LP1  (via drill 0.41)
  Top 0.254: IC13.12 74.3,13.97 73.03,15.24 70.8,15.24 70.17,15.88 65.41,15.88 63.5,17.78 59.69,17.78 59.05,18.41 51.44,18.41 R43.2 48.89,18.41 45.72,18.41 43.18,15.88 39.37,15.88 37.21,18.03 33.4,18.03 33.02,18.41 26.67,18.41 26.04,17.78 26.04,16.51 25.4,15.88 24.13,15.88 23.5,16.51 23.5,20.95 22.86,21.59 21.59,21.59 20.96,20.95 20.96,18.41 19.05,16.51 16.51,16.51 15.88,17.14 15.88,17.78 14.61,19.05 11.43,19.05 10.16,20.32 10.16,29.84 11.43,31.11 v14.61,31.11
  Bottom 0.254: v14.61,31.11 IC6.7
  Bottom 0.406: IC6.7 C35.2
LP2  (via drill 0.41, 0.8)
  Top 0.254: v51.44,21.27 52.39,21.27 52.7,20.95 59.05,20.95 60.96,19.05 72.39,19.05 73.66,17.78 77.47,17.78 79.38,19.68 81.28,19.68 85.72,24.13 85.72,25.4 86.36,26.04 90.8,26.04 92.08,27.3 IC10.1 | C46.2 v92.08,23.49
  Bottom 0.254: C46.2 93.34,24.76 92.08,26.04 IC10.1 | IC12.12 48.89,13.97 51.44,16.51 v51.44,21.27 51.44,29.84 53.98,32.38 53.98,42.55 52.7,43.82 R26.2
MIX  (via drill 0.41)
  Top 0.254: v45.09,15.56 51.12,15.56 R42.1 | C13A.2 13.97,57.52 13.97,57.79 14.61,58.42 18.41,58.42 19.68,59.69 IC2.1 21.59,61.59 23.5,63.5 38.73,63.5 41.27,60.96 43.18,60.96 43.81,60.33 v43.81,55.88
  Top 0.406: R13.2 12.07,55.88 C13.2 C13A.2
  Bottom 0.254: IC12.3 43.81,6.35 45.09,7.62 v45.09,15.56 45.72,16.19 45.72,47.62 43.81,49.53 v43.81,55.88
N$1
  Top 0.61: C3.+ C2.+ 102.87,72.39 104.78,70.48 104.78,68.58 105.41,67.95 106.05,67.95 106.68,67.31 IC1.2 106.68,63.5 106.05,62.87 99.69,62.87 98.69,62.87 C7A.1 C7.1
N$2
  Top 0.406: R16.2 R19.2 | R16.2 R11.1 C12.1 C12A.1 | IC4.6 R16.2
N$3
  Top 1.016: SW.1 J1.3
N$4
  Top 1.016: C16.+ 116.2,53.98 117.47,52.71 117.47,15.88 115.57,13.97 113.3,11.7 C57A.1 112.39,10.16 111.76,9.53 | C16.+ D1.C D1A.C | IC1.8 109.22,55.25 110.49,53.98 C16.+ | 111.76,9.53 111.76,8.26 109.86,6.35 IC14.1 | 111.76,9.53 C57.1
N$5
  Top 0.61: C3.- C2.- IC1.4
N$6
  Top 0.406: R20.2 R17.2 R13.1 18.41,55.88 | IC2.2 19.68,57.15 18.41,55.88 | 18.41,55.88 C13.1 C13A.1
N$7  (via drill 0.7)
  Top 0.406: R6.1 R6.2
  Top 0.61: v81.92,63.5 R6.1 | R6.2 v79.38,66.04
  Bottom 0.254: R19.1 85.72,52.07 82.55,55.25 82.55,61.59 81.92,62.23 v81.92,63.5
N$8  (via drill 0.7)
  Top 0.254: J4.6 8.89,64.77 10.16,66.04 16.51,66.04 17.14,65.41 59.05,65.41 60.96,67.31 64.77,67.31 67.31,69.85 79.38,69.85 R6.3
  Top 0.61: R6.3 v81.92,68.58
N$9  (via drill 0.7)
  Top 0.406: R7.1 R7.2
  Top 0.61: R7.2 v84.45,66.04 | R7.1 v87,63.5
  Bottom 0.254: R16.1 85.72,54.61 83.82,56.52 83.82,61.59 R7.1
N$10
  Top 0.406: IC7.10 R24.1 R23.2
N$11
  Top 0.254: IC7.12 34.93,36.2 34.29,36.83 33.66,36.83 33.02,37.47 33.02,48.9 36.2,52.07 R53.2 38.73,53.34 45.72,53.34 46.35,53.98 46.35,55.88 | C10A.1 44.45,61.87 44.45,60.96 45.09,60.33 R9.2 46.35,55.88 | 46.35,55.88 47.62,57.15 IC3.2
  Top 0.406: C10A.1 C10.1
N$12
  Top 0.254: R45.2 56.52,23.49 51.44,23.49 R43.1
  Top 0.406: R41.1 R43.1 52.7,27.3 IC8.2
N$13  (via drill 0.41)
  Top 0.254: J6.5 7.62,28.57 9.53,26.67 9.53,17.78 11.43,15.88 18.41,15.88 v19.68,15.88
  Bottom 0.254: v19.68,15.88 20.32,15.24 24.13,15.24 24.77,14.61 IC11.12
N$14
  Top 0.254: J6.3 6.35,23.49 5.08,22.22 5.08,16.51 6.99,14.61 18.41,14.61 19.68,13.34 IC11.14
N$15
  Top 0.254: 17.14,2.54 18.41,3.81 18.41,6.35 19.05,6.98 26.67,6.98 27.3,6.35 IC11.6
  Top 0.305: 17.14,2.54 13.97,2.54 12.7,3.81 10.79,3.81 R51.2
N$16
  Top 0.254: J6.4 7.62,26.04 8.89,24.76 8.89,17.14 10.79,15.24 19.05,15.24 19.68,14.61 26.04,14.61 27.3,13.34 IC11.11
N$17
  Top 0.406: R22.1 C24.1 C24A.1
N$18
  Top 0.254: 55.24,36.2 IC8.6
  Top 0.406: R29.2 60.33,40.01 59.69,40.64 53.34,40.64 52.7,40.01 R26.1 | R26.1 55.24,36.2 | R25.1 R26.1
N$19  (via drill 0.8)
  Top 0.254: 14.61,26.04 14.61,27.3 IC6.2 16.51,29.84 31.75,29.84 32.38,29.21 IC7.4 | D5.A 14.61,22.86
  Top 0.406: C39.1 14.61,26.04 | 14.61,22.86 C39.1 | C39.1 v15.88,24.76
  Bottom 0.406: IC7.4 R44.2
N$20  (via drill 0.8)
  Top 0.254: IC10.6 97.16,34.29 96.52,33.66 90.17,33.66 89.53,34.29 | 89.53,34.29 88.9,33.66 80.01,33.66 79.38,34.29 IC9.12 | 89.53,34.29 R56.2 | C33.1 v98.42,40.01
  Top 0.406: IC10.6 C33.1 D3.A
N$21
  Top 0.406: R40.1 R39.2 IC7.7
N$22
  Top 0.406: R14.2 40.01,54.61 R9.1 C9.1 C9A.1
N$23  (via drill 0.41)
  Top 0.254: 59.05,37.47 60.96,37.47 62.87,39.37 66.04,42.55 71.75,42.55 73.03,41.28 73.03,38.1 73.66,37.47 74.93,37.47 75.56,36.83 v75.56,33.66 | 59.05,37.47 57.78,36.2 IC8.5 | 59.05,37.47 R28.2 | R30.1 83.19,26.04 78.11,26.04 76.83,27.3 IC9.4
  Top 0.406: R28.2 R27.2 | C56.1 C56A.1
  Bottom 0.254: 76.83,29.21 IC9.4 76.83,32.38 v75.56,33.66 | R30.1 C56.1
N$24
  Top 0.406: R47.1 R48.2 IC9.2
N$25
  Top 0.61: R3.1 60.33,80.64 58.46,78.78 R2.E
N$26
  Top 0.406: IC7.15 R22.2
  Bottom 0.406: IC7.15 27.3,31.11 26.04,29.84 26.04,26.04 R36.2
N$27
  Top 0.406: C42.1 C42A.1
  Bottom 0.254: C42.1 37.47,18.41 38.73,17.14 R39.1
N$28  (via drill 0.8)
  Top 0.254: IC7.13 32.38,36.2 32.38,46.36 31.11,47.62 26.04,47.62 R55.2 | IC6.6 17.14,36.2 18.41,37.47 v18.41,41.28
  Top 0.406: v18.41,41.28 C35.1
  Bottom 0.406: R55.2 22.23,42.55 20.96,41.28 v18.41,41.28
N$29
  Top 0.406: R37.2 IC7.2
  Bottom 0.406: R37.2 R38.2
N$30
  Top 0.406: C41.1 C41A.1
  Bottom 0.254: R38.1 29.84,19.05 30.48,19.68 C41.1
N$31  (via drill 0.41)
  Top 0.254: v26.04,21.59 27.94,21.59 28.57,22.22 28.57,25.4 29.21,26.04 33.66,26.04 34.93,27.3 IC7.5 34.93,29.21 35.56,29.84 54.61,29.84 55.24,29.21 IC8.3 | R54.1 v22.23,20.32
  Top 0.406: R42.2 R46.2 IC8.3 | C55.1 C55A.1
  Bottom 0.254: v22.23,20.32 23.5,21.59 v26.04,21.59 | C55.1 20.32,17.78 20.96,17.14 R54.1
N$32
  Top 0.254: 58.74,10.16 59.37,9.53 60.64,9.53 61.12,10 | 61.12,10 61.28,10.16 | LED1.A 86.25,10.68 85.72,10.16 61.28,10.16 | 61.12,10 61.28,10.16 | R51.1 10.16,10.79 10.79,10.79 11.43,11.43 12.7,11.43
  Top 0.305: 58.74,10.16 13.97,10.16 12.7,11.43
N$33
  Top 0.406: D2.C D3.C
N$34
  Top 0.406: R49.2 R50.2
  Bottom 0.406: R50.2 84.45,27.3 IC9.7
N$35
  Top 0.254: J4.1 8.89,50.16 8.89,42.55 C34.+
N$36
  Top 0.61: IC1.7 106.68,59.69 106.05,60.33 99.69,60.33 98.69,60.33 C7A.2 C7.2
N$38
  Top 0.61: J2.T 17.29,73.52 13.97,76.84 R1.E
N$39
  Top 0.254: C34.- 9.53,40.64 9.53,48.26 R20.1
N$40
  Top 0.406: R10.1 C11.1 C11A.1 | R10.1 R15.2 R18.2 | R10.1 IC4.2
N$41  (via drill 0.7)
  Top 0.406: R5.1 R5.2
  Top 0.61: R5.2 v66.67,66.04 | R5.1 v69.22,63.5
  Bottom 0.254: R18.1 62.87,52.07 64.77,53.98 64.77,60.96 66.04,62.23 66.67,62.23 R5.1
N$42  (via drill 0.7)
  Top 0.254: J4.3 8.26,57.15 8.89,57.79 8.89,63.5 10.79,65.41 15.88,65.41 16.51,64.77 20.32,64.77 20.96,64.77 63.5,64.77 66.04,67.31 66.67,67.31 R5.3
  Top 0.61: R5.3 v69.22,68.58
N$43  (via drill 0.7)
  Top 0.61: R4.1 v64.14,63.5 | R4.2 v61.59,66.04
  Bottom 0.254: R15.1 61.59,54.61 63.5,56.52 63.5,60.96 62.87,61.59 R4.1
  Bottom 0.406: R4.1 R4.2
N$44
  Top 0.254: 94.61,26.04 IC10.2 94.61,29.21 93.98,29.84 80.01,29.84 79.38,29.21 IC9.5 | 94.61,26.04 95.89,24.76 C46.1 | 94.61,26.04 93.98,25.4 90.17,25.4 R57.2
N$45
  Top 0.254: J4.2 8.26,54.61 8.89,53.98 8.89,52.07 10.16,50.8 13.34,50.8 15.88,48.26 17.14,48.26 25.4,48.26 31.11,48.26 R14.1
N$46
  Top 0.406: C45A.1 C45.1
  Bottom 0.254: C45.1 R49.1
N$47
  Top 0.61: J3.T 36.97,78.25 40.01,81.28 51.44,81.28 52.07,80.64 53.98,80.64 54.61,81.28 R2.S
N$49
  Top 0.406: C44.1 C44A.1
  Bottom 0.254: R48.1 C44.1
N$50
  Top 0.406: R34.2 R35.2 IC9.10
N$51
  Top 0.406: R34.1 C30.1 C30A.1
N$52
  Top 0.254: 13.34,9.53 58.42,9.53 59.05,8.89 60.96,8.89 61.59,9.53 87,9.53 87.63,10.16 LED2.A
  Top 0.305: 13.34,9.53 12.7,9.53 R52.1
N$53
  Bottom 0.305: IC11.7 29.84,4.45 29.84,3.81 27.94,1.91 13.97,1.91 13.34,2.54 R52.2
N$55
  Top 0.406: D4.C D5.C
N$56
  Top 0.254: C10.2 48.26,61.59 IC3.1 50.16,59.69 50.8,59.05 50.8,53.98 50.16,53.34 46.99,53.34 44.45,50.8 36.2,50.8 33.66,48.26 33.66,38.1 34.29,37.47 36.83,37.47 37.47,36.83 IC7.11 37.47,34.29 38.1,33.66 73.66,33.66 74.3,34.29 IC9.14
  Top 0.406: C10.2 C10A.2
N$57
  Top 0.406: C20.- 66.29,49.28 R31.1
N$58
  Top 0.61: IC1.5 101.6,52.71 102.87,51.44 C15.- 104.14,33.66 105.41,32.38 109.86,32.38 110.49,31.75 IC5.2 110.49,26.67 C58.2 C58A.2
N$59
  Top 1.016: 113.03,69.85 SW.2 | 113.03,69.85 D1.A | D1A.A 113.67,69.22 113.03,69.85
N$60
  Top 0.254: R32.1 73.03,47.62 75.25,47.62 76.9,49.28 C21.-
N$61
  Top 0.406: IC3.6 IC3.7
N$62
  Bottom 0.254: IC13.2 66.67,8.89 69.22,11.43 IC13.14
N$63  (via drill 0.41)
  Top 0.406: IC2.7 31.75,57.15 32.38,57.79 R12.1 C14.2 C14A.2 | R3.2 45.72,76.2 v40.01,70.48
  Bottom 0.406: v40.01,70.48 40.01,67.31 34.93,62.23 C14.2
N$64
  Top 0.406: R23.1 C25.1 C25A.1
N$65
  Top 0.406: C29A.1 C29.1
  Bottom 0.254: C29.1 R33.1
N$66
  Top 0.61: C1.+ 10.79,72.39 10.16,73.03 10.16,80.64 10.79,81.28 R1.S
N$67
  Top 0.406: R31.2 R32.2 IC9.15
  Bottom 0.254: R32.2 R33.2
N$69  (via drill 0.41)
  Top 0.254: J4.4 5.71,59.69 5.08,59.05 v5.08,44.45
  Bottom 0.254: v5.08,44.45 R21.1
N$70  (via drill 0.41)
  Top 0.254: IC9.13 76.83,36.83 75.56,38.1 75.56,41.91 74.3,43.18 50.16,43.18 48.89,44.45 44.45,44.45 40.01,48.9 v37.47,48.9
  Top 0.406: IC2.6 31.75,54.61 32.38,53.98 | 32.38,53.98 33.02,54.61 C14.1 C14A.1 | 32.38,53.98 R12.2
  Bottom 0.254: v37.47,48.9 34.93,51.44 C14.1
N$72  (via drill 0.41)
  Top 0.254: R17.1 9.53,53.34 9.53,62.87 10.79,64.14 v12.07,64.14
  Bottom 0.254: v12.07,64.14 C1.-
N$73
  Bottom 0.254: J4.5 R8.1
N$74
  Bottom 0.254: IC12.2 41.27,6.35 43.81,8.89 IC12.14
N$75
  Bottom 0.254: IC12.4 46.35,6.35 50.16,10.16 50.16,13.97 50.8,14.61 52.07,14.61 53.98,16.51 53.98,21.59 53.98,22.86 53.98,29.84 56.52,32.38 56.52,42.55 55.24,43.82 R27.1
RES1_CV  (via drill 0.41)
  Top 0.254: v36.2,33.66 21.59,33.66 20.96,34.29 20.96,41.91 R21.2
  Top 0.406: R21.2 18.41,45.72 C22.1 C22A.1
  Bottom 0.254: v36.2,33.66 36.2,31.75 37.47,30.48 IC7.6
RES2_CV  (via drill 0.41)
  Top 0.254: IC9.3 74.3,29.21 73.66,29.84 v61.59,29.84 | v59.05,49.53 55.88,49.53 53.98,51.44 53.98,59.05 48.89,64.14 20.32,64.14 R8.2 18.41,60.96 C8.1
  Top 0.406: C8A.1 C8.1
  Bottom 0.254: v59.05,49.53 59.05,32.38 v61.59,29.84
VCC  (via drill 0.6)
  Top 0.254: IC13.16 62.87,12.7 62.23,12.07 62.23,11.43
  Top 0.305: C50.1 IC11.16 14.61,11.43 15.24,10.79 28.57,10.79 29.84,12.07 | 29.84,12.07 31.11,10.79 35.56,10.79 | 35.56,10.79 C51.1 | 35.56,10.79 C52.1 61.59,10.79 62.23,11.43 62.87,10.79 84.45,10.79 85.09,11.43 85.09,13.97 86.36,15.24 90.17,15.24 92.08,17.14 100.33,17.14 101.6,18.41 | 29.84,12.07 IC11.10
  Top 0.406: C28.1 C28A.1 | C6.1 C6A.1 | C52.1 C52A.1 | C50A.1 C50.1 | C36.1 C36A.1 | C23.1 C23A.1 | C51.1 C51A.1 35.7,12.7 IC12.16 | C43.1 C43A.1 | C32.1 C32A.1 | C5.1 C5A.1 | C4.1 C4A.1 | 101.6,18.41 101.6,20.32 102.87,21.59
  Top 0.61: IC7.16 C23.1 | IC10.8 C32.1 | v26.67,67.95 v53.98,67.95 57.78,67.95 62.23,72.39 v74.3,72.39 88.9,72.39 92.08,69.22 92.08,57.79 101.6,48.26 101.6,39.37 102.87,38.1 v102.87,32.38 v92.08,32.38 v66.67,32.38 v47.62,32.38 v24.77,32.38 12.7,32.38 12.07,33.02 | 12.07,33.02 8.89,33.02 4.45,37.47 4.45,41.28 6.99,43.82 J5.2 | IC2.8 27.3,59.69 26.67,60.33 C4.1 | IC3.8 55.24,59.69 53.98,60.96 C5.1 | IC9.16 67.31,35.56 C28.1 | 12.07,33.02 IC6.8 C36.1 | IC8.8 50.16,36.2 C43.1 | C49.+ 104.78,21.59 102.87,21.59 101.6,22.86 101.6,28.57 v102.87,29.84 | IC4.8 76.83,59.69 76.2,60.33 C6.1 74.93,62.87 74.3,63.5 v74.3,68.58 | C48.1 C48A.1
  Top 1.016: IC14.3 107.31,11.43 C48.1 107.31,20.32 106.17,21.46 C49.+
  Bottom 0.61: v102.87,29.84 v102.87,32.38 | v24.77,32.38 IC7.16 | v92.08,32.38 IC10.8 | v26.67,67.95 C4.1 | v53.98,67.95 C5.1 | v74.3,72.39 v74.3,68.58 | v66.67,32.38 C28.1 | v47.62,32.38 C43.1
VEE  (via drill 0.6, 0.7)
  Top 0.406: IC12.7 53.98,3.81 54.61,3.17 55.88,3.17 56.52,2.54 C53.2 60.96,2.54 61.23,2.81 C53A.2 61.64,2.81 63.18,1.27 75.56,1.27 76.83,2.54 78.74,2.54 79.38,3.17 | 79.38,3.17 80.01,2.54 82.87,2.54 83.5,3.17 83.5,7.11 84.01,7.62 C54.2 C54A.2 | 79.38,3.17 IC13.7 | v83.82,12.07 83.82,14.29 87.95,18.41 99.69,18.41 100.33,19.05 100.33,24.13 99.69,24.76 C47.2 C47A.2 | C31.2 C31A.2 | C17.2 C17A.2 | C18.2 C18A.2 | C19.2 C19A.2 | C27.2 C27A.2 | C26.2 C26A.2 41.01,40.28 40.01,41.28 R24.2 | C40A.2 C40.2
  Top 0.61: v19.68,31.11 v42.55,31.11 57.15,31.11 57.78,30.48 | 57.78,30.48 58.42,31.11 v87,31.11 99.69,31.11 | 99.69,31.11 v101.6,31.11 103.5,31.11 104.14,30.48 104.14,28.57 102.87,27.3 102.87,25.4 104.14,24.13 111.12,24.13 | 99.69,31.11 IC10.4 99.69,27.3 98.42,26.04 C47.2 | v101.6,33.66 101.6,37.47 100.33,38.73 100.33,47.62 90.8,57.15 90.8,68.58 88.27,71.12 86.36,71.12 85.72,70.48 | v24.13,66.67 v52.07,66.67 58.42,66.67 61.28,69.53 61.91,69.53 | v52.07,59.05 52.07,52.71 51.44,52.07 | 51.44,52.07 52.07,51.44 C18.2 | v73.03,67.31 73.03,52.71 72.39,52.07 | 72.39,52.07 73.66,50.8 C19.2 | 72.39,52.07 IC4.4 | IC7.9 C26.2 | IC9.9 C31.2 | 85.72,70.48 85.09,71.12 v73.03,71.12 62.87,71.12 61.91,70.17 61.91,69.53 | 85.72,70.48 R7.3 v87,68.58 | 61.91,69.53 R4.3 v64.14,68.58 | C27.2 59.69,27.94 IC8.4 57.78,30.48 | IC2.4 22.23,52.07 22.86,51.44 22.86,50.8 C17.2 v24.13,62.23 | 51.44,52.07 IC3.4 | C38.2 C38A.2
  Top 1.016: C37.- 112.27,17.91 111.12,19.05 111.12,24.13 113.03,26.04 IC5.3 C38.2
  Bottom 0.254: R24.2 R53.1
  Bottom 0.406: v83.82,12.07 83.82,8.89 C54.2
  Bottom 0.61: v42.55,31.11 IC7.9 | v87,31.11 IC9.9 | v101.6,31.11 v101.6,33.66 | v52.07,66.67 v52.07,59.05 | v73.03,71.12 v73.03,67.31 | v24.13,66.67 v24.13,62.23 | v19.68,31.11 IC6.4 C40.2

### Text on the board
Top: Old Crow's Mutable | CS80 SVF v0.1
tPlace: cc-by-sa | FCV2> | QCV2> | QCV1> | FCV1> | VCA> | OSC> | opt. | GND | oldcrow@oldcrows.net | * | http://www.cs80.com/shruthi | +5V | RX> | EN> | CLK> | SER> | GND | (+5V) | *
tNames: Olivier Gillet | Frank Daniels | Scott Rider | IN | OUT | MAR 2014 | Range | V/Oct | V/Oct | Range
tValues: 2.4V | 2.4V
tStop: Old Crow's Mutable | CS80 SVF v0.1